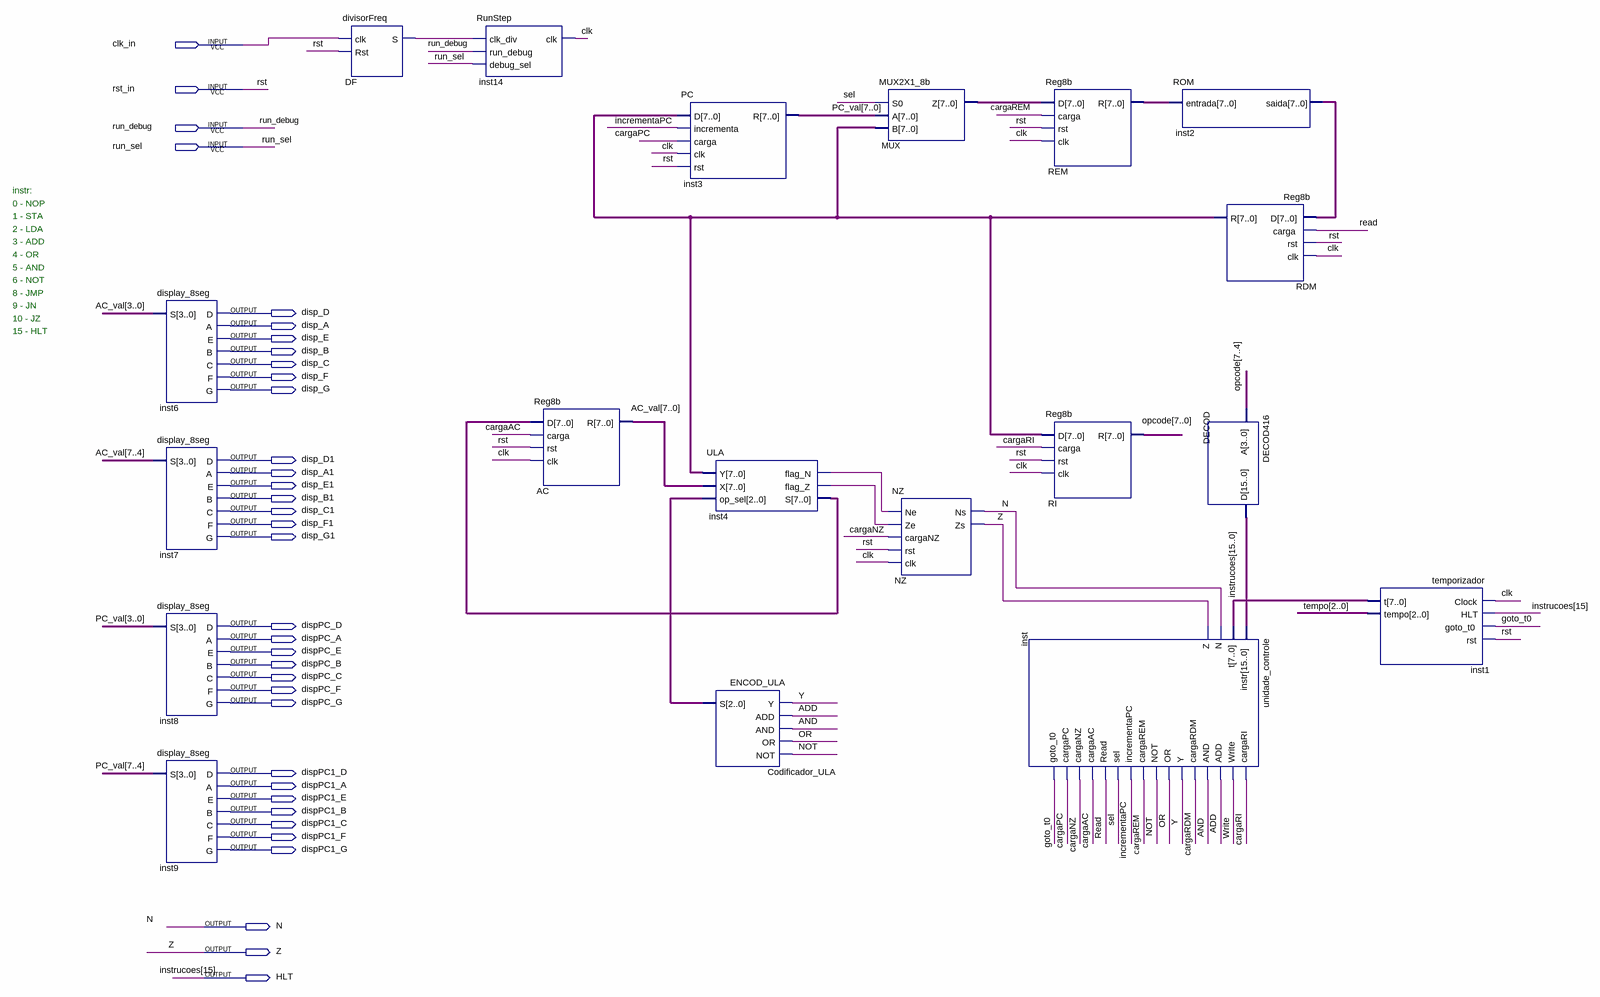
[diagram p0: schematic sheet]
// Quartus schematic Neander.bdf as structural Verilog: 19 symbols, 35 pins
module Neander (
  input  clk_in,
  input  rst_in,
  input  run_debug,
  input  run_sel,
  output disp_D,
  output disp_A,
  output disp_E,
  output disp_B,
  output disp_C,
  output disp_F,
  output disp_G,
  output disp_D1,
  output disp_A1,
  output disp_E1,
  output disp_B1,
  output disp_C1,
  output disp_F1,
  output disp_G1,
  output dispPC_D,
  output dispPC_A,
  output dispPC_E,
  output dispPC_B,
  output dispPC_C,
  output dispPC_F,
  output dispPC_G,
  output dispPC1_D,
  output dispPC1_A,
  output dispPC1_E,
  output dispPC1_B,
  output dispPC1_C,
  output dispPC1_F,
  output dispPC1_G,
  output N,
  output Z,
  output HLT
);

  wire ADD, AND, cargaAC, cargaNZ, cargaPC, cargaRDM, cargaREM, cargaRI, clk, DF_s, goto_t0, incrementaPC,
       inst4_flag_n, inst4_flag_z, NOT, OR, read, sel, Write, Y;
  wire [2:0] Codificador_ULA_s, tempo;
  wire [7:0] AC_val, inst1_t, inst2_saida, inst4_s, MUX_z, opcode, PC_val, RDM_r, REM_r;
  wire [14:0] instrucoes;

  display_8seg inst6 (
    .S(AC_val[3:0]), .D(disp_D), .A(disp_A), .E(disp_E), .B(disp_B), .C(disp_C), .F(disp_F), .G(disp_G));
  display_8seg inst7 (
    .S(AC_val[7:4]), .D(disp_D1), .A(disp_A1), .E(disp_E1), .B(disp_B1), .C(disp_C1), .F(disp_F1), .G(disp_G1));
  display_8seg inst8 (
    .S(PC_val[3:0]), .D(dispPC_D), .A(dispPC_A), .E(dispPC_E), .B(dispPC_B), .C(dispPC_C), .F(dispPC_F),
    .G(dispPC_G));
  display_8seg inst9 (
    .S(PC_val[7:4]), .D(dispPC1_D), .A(dispPC1_A), .E(dispPC1_E), .B(dispPC1_B), .C(dispPC1_C),
    .F(dispPC1_F), .G(dispPC1_G));
  divisorFreq DF (.clk(clk_in), .Rst(rst_in), .S(DF_s));
  RunStep inst14 (.clk_div(DF_s), .run_debug(run_debug), .debug_sel(run_sel), .clk(clk));
  Reg8b AC (.D(inst4_s), .carga(cargaAC), .rst(rst_in), .clk(clk), .R(AC_val));
  PC inst3 (.D(RDM_r), .incrementa(incrementaPC), .carga(cargaPC), .clk(clk), .rst(rst_in), .R(PC_val));
  ULA inst4 (
    .Y(RDM_r), .X(AC_val), .op_sel(Codificador_ULA_s), .flag_N(inst4_flag_n), .flag_Z(inst4_flag_z),
    .S(inst4_s));
  ENCOD_ULA Codificador_ULA (.Y(Y), .ADD(ADD), .AND(AND), .OR(OR), .NOT(NOT), .S(Codificador_ULA_s));
  MUX2X1_8b MUX (.S0(sel), .A(PC_val), .B(RDM_r), .Z(MUX_z));
  NZ NZ (.Ne(inst4_flag_n), .Ze(inst4_flag_z), .cargaNZ(cargaNZ), .rst(rst_in), .clk(clk), .Ns(N), .Zs(Z));
  Reg8b REM (.D(MUX_z), .carga(cargaREM), .rst(rst_in), .clk(clk), .R(REM_r));
  Reg8b RI (.D(RDM_r), .carga(cargaRI), .rst(rst_in), .clk(clk), .R(opcode));
  unidade_controle inst (
    .instr({HLT, instrucoes}), .t(inst1_t), .N(N), .Z(Z), .cargaRI(cargaRI), .Write(Write), .ADD(ADD),
    .AND(AND), .cargaRDM(cargaRDM), .Y(Y), .OR(OR), .NOT(NOT), .cargaREM(cargaREM),
    .incrementaPC(incrementaPC), .sel(sel), .Read(read), .cargaAC(cargaAC), .cargaNZ(cargaNZ),
    .cargaPC(cargaPC), .goto_t0(goto_t0));
  ROM inst2 (.entrada(REM_r), .saida(inst2_saida));
  DECOD416 DECOD (.A(opcode[7:4]), .D({HLT, instrucoes}));
  Reg8b RDM (.D(inst2_saida), .carga(read), .rst(rst_in), .clk(clk), .R(RDM_r));
  temporizador inst1 (.Clock(clk), .HLT(HLT), .goto_t0(goto_t0), .rst(rst_in), .t(inst1_t), .tempo(tempo));

  // Other names for the same wires on the sheet: instrucoes[15] = HLT; rst = rst_in

  // Notes on the sheet:
  //   instr:
  //   0 - NOP
  //   1 - STA
  //   2 - LDA
  //   3 - ADD
  //   4 - OR
  //   5 - AND
  //   6 - NOT
  //   8 - JMP
  //   9 - JN
  //   10 - JZ
  //   15 - HLT
endmodule
